# EAGLE design sv20-mega (EAGLE 9.6.2)
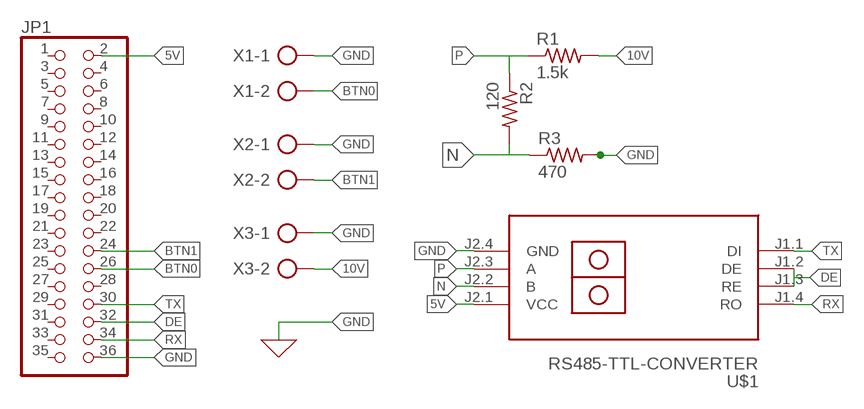
[diagram p0: schematic, sheet 1]

## Parts
JP1  PINHD-2X18  [2X18]
R1  1.5k  R-US_0204/7  [0204/7]
R2  120  R-US_0204/7  [0204/7]
R3  470  R-US_0204/7  [0204/7]
U$1  RS485-TTL-CONVERTER  [RS485-TTL-CONVERTER]
X1  AK300/2  [AK300/2]
X2  AK300/2  [AK300/2]
X3  AK300/2  [AK300/2]

## Nets
5V: JP1.2 U$1.J2.1(VCC)
10V: R1.2 X3.2
BTN0: JP1.26 X1.2
BTN1: JP1.24 X2.2
DE: JP1.32 U$1.J1.2(DE) U$1.J1.3(RE)
GND: JP1.36 R3.2 U$1.J2.4(GND) X1.1 X2.1 X3.1
N: R2.2 R3.1 U$1.J2.2(B)
P: R1.1 R2.1 U$1.J2.3(A)
RX: JP1.34 U$1.J1.4(RO)
TX: JP1.30 U$1.J1.1(DI)
Unconnected: JP1.1 JP1.3 JP1.4 JP1.5 JP1.6 JP1.7 JP1.8 JP1.9 JP1.10 JP1.11 JP1.12 JP1.13 JP1.14 JP1.15 JP1.16 JP1.17 JP1.18 JP1.19 JP1.20 JP1.21 JP1.22 JP1.23 JP1.25 JP1.27 JP1.28 JP1.29 JP1.31 JP1.33 JP1.35

## Library data of the parts
JP1 = pinhead:PINHD-2X18: PIN HEADER
R1-R3 = rcl:R-US_: RESISTOR, American symbol; SPICEPREFIX: R
U$1 = diy-modules:RS485-TTL-CONVERTER: RS485 to TTL converter based on MAX485 chip
X1-X3 = con-ptr500:AK300/2: CONNECTOR; OC_FARNELL: unknown; OC_NEWARK: unknown

## Board
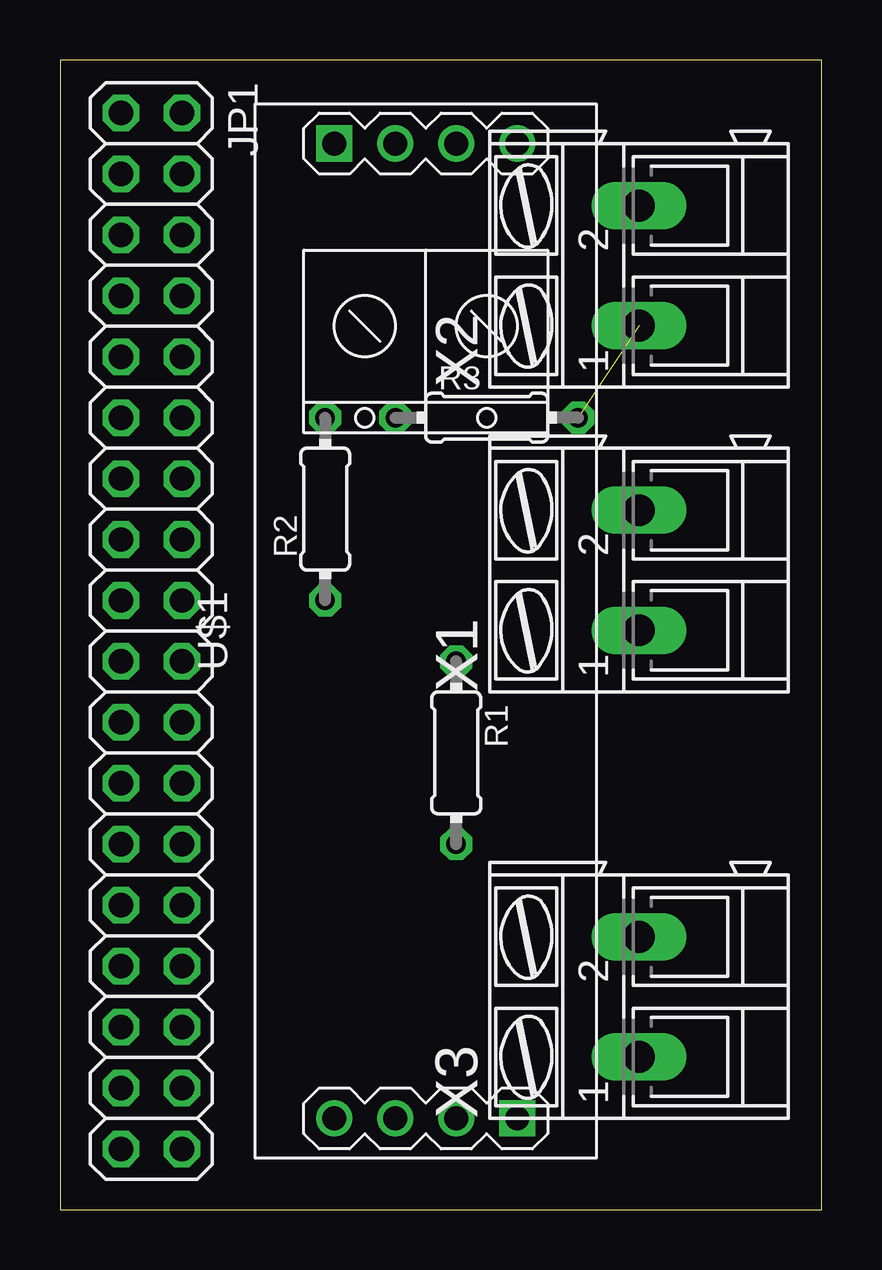
[diagram p1: board, top side]
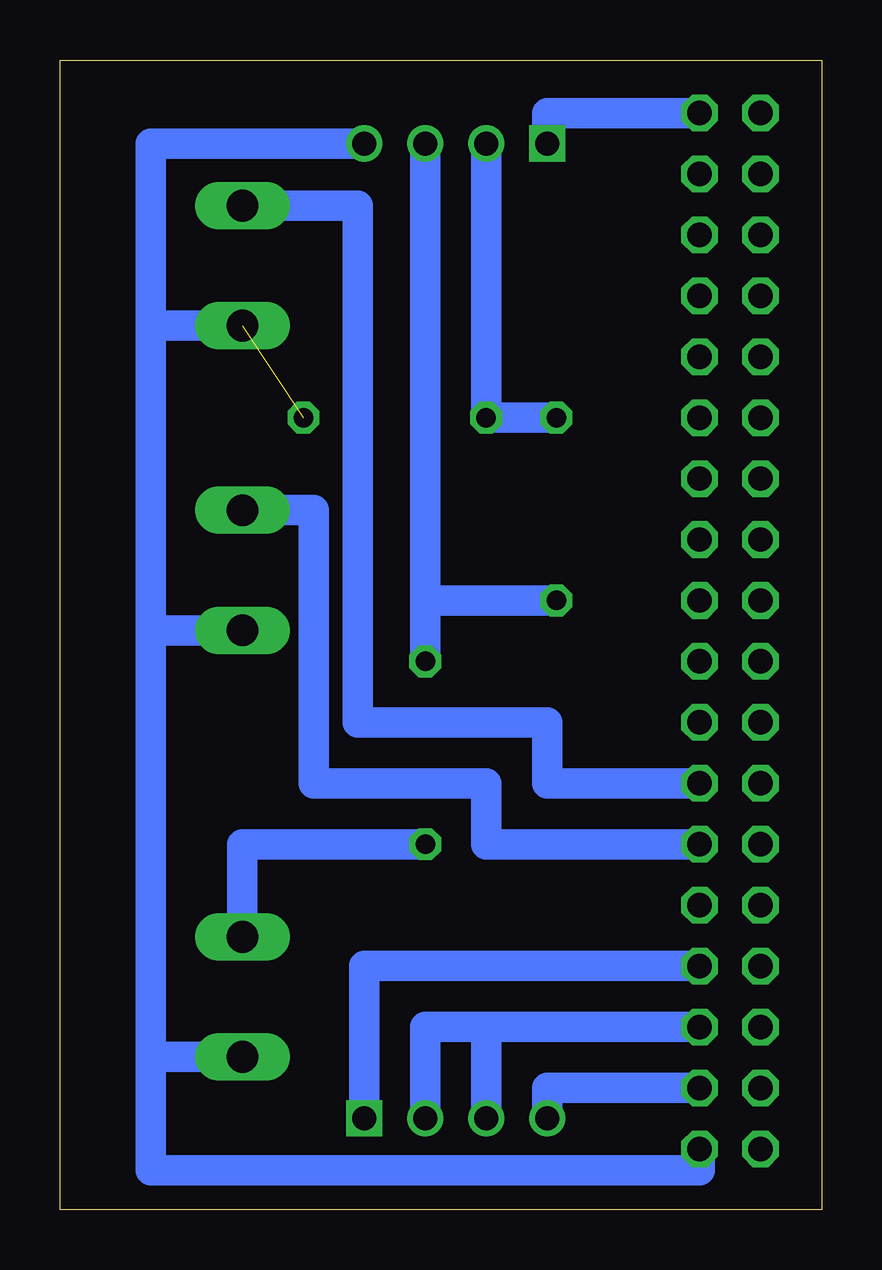
[diagram p2: board, bottom side, seen from below]

Size 31.73 x 47.93 mm. Coordinates in mm from the lower left corner, seen from the top.
Outline: 0,0 31.73,0 31.73,47.93 0,47.93 0,0
Copper layers (1*16): Top 0.035mm / dielectric 1.5mm / Bottom 0.035mm
Design rules "default": minimum track width 6mil, minimum drill 0.35mm, track to track 6mil, track to pad 6mil, pad to pad 6mil, via to via 6mil, smd to smd 6mil, copper to edge 40mil, drill to drill 6mil, minimum pad ring 10mil, minimum via ring 8mil, stop-mask expansion 4mil, vias tented up to drill 0mil, thermal gap 10mil

### Footprints (pad centres in the part's own frame; a part is rotated, then mirrored left to right if it is on the bottom)
2X18 = drill 1.016 octagon: 1 -21.59,-1.27; 2 -21.59,1.27; 3 -19.05,-1.27; 4 -19.05,1.27; 5 -16.51,-1.27; 6 -16.51,1.27; 7 -13.97,-1.27; 8 -13.97,1.27; 9 -11.43,-1.27; 10 -11.43,1.27; 11 -8.89,-1.27; 12 -8.89,1.27; 13 -6.35,-1.27; 14 -6.35,1.27; 15 -3.81,-1.27; 16 -3.81,1.27; 17 -1.27,-1.27; 18 -1.27,1.27; 19 1.27,-1.27; 20 1.27,1.27; 21 3.81,-1.27; 22 3.81,1.27; 23 6.35,-1.27; 24 6.35,1.27; 25 8.89,-1.27; 26 8.89,1.27; 27 11.43,-1.27; 28 11.43,1.27; 29 13.97,-1.27; 30 13.97,1.27; 31 16.51,-1.27; 32 16.51,1.27; 33 19.05,-1.27; 34 19.05,1.27; 35 21.59,-1.27; 36 21.59,1.27
0204/7 = drill 0.813 octagon: 1 -3.81,0; 2 3.81,0
RS485-TTL-CONVERTER = drill 1 square: J1.1 -20.32,-3.81; J2.1 20.32,3.81 | drill 1: J1.2 -20.32,-1.27; J1.3 -20.32,1.27; J1.4 -20.32,3.81; J2.2 20.32,1.27; J2.3 20.32,-1.27; J2.4 20.32,-3.81
AK300/2 = drill 1.321 long: 1 -2.515,0; 2 2.489,0

### Placement (x,y rotation side)
JP1  3.81,24.13 270 top
R1  16.51,19.05 270 top
R2  11.05,29.21 90 top
R3  17.78,33.02 0 top
U$1  15.24,24.13 90 top
X1  24.13,26.67 90 top
X2  24.13,39.37 90 top
X3  24.13,8.89 90 top

### Tracks (layer width: path | path; a pad name or v marks a point on that pad's centre or on a via)
5V
  Bottom 1.27: U$1.J2.1 11.43,45.72 JP1.2
10V
  Bottom 1.27: R1.2 24.13,15.24 X3.2
BTN0
  Bottom 1.27: X1.2 21.16,29.16 21.16,17.78 13.97,17.78 13.97,15.24 JP1.26
BTN1
  Bottom 1.27: X2.2 19.33,41.86 19.33,20.32 11.43,20.32 11.43,17.78 JP1.24
DE
  Bottom 1.27: U$1.J1.3 13.97,7.62 | 13.97,7.62 JP1.32 | U$1.J1.2 16.51,7.62 13.97,7.62
GND  (1 unrouted)
  Bottom 1.27: X3.1 27.94,6.38 | 27.94,6.38 27.94,1.65 5.08,1.65 JP1.36 | 27.94,6.38 27.94,24.16 | X1.1 27.94,24.16 | 27.94,24.16 27.94,33.02 27.94,36.85 | 27.94,36.85 X2.1 | 27.94,36.85 27.94,44.45 U$1.J2.4
N
  Bottom 1.27: U$1.J2.2 R3.1 R2.2
P
  Bottom 1.27: R1.1 16.51,25.4 | 16.51,25.4 U$1.J2.3 | R2.1 16.51,25.4
RX
  Bottom 1.27: U$1.J1.4 11.43,5.08 JP1.34
TX
  Bottom 1.27: U$1.J1.1 19.05,10.16 JP1.30